# Altium schematic sheet Mach trai tim.SchDoc: Bài 1: Mạch trái tim
size A4; DrawnBy: Lai Phuoc Son; Address1: PCB Workshop 2017; Address3: Lpson.tth@gmail.com; Address4: 0905.912.019; Revision: V1-1; SheetNumber: 1; SheetTotal: 1; ModifiedDate: 2014-06-07
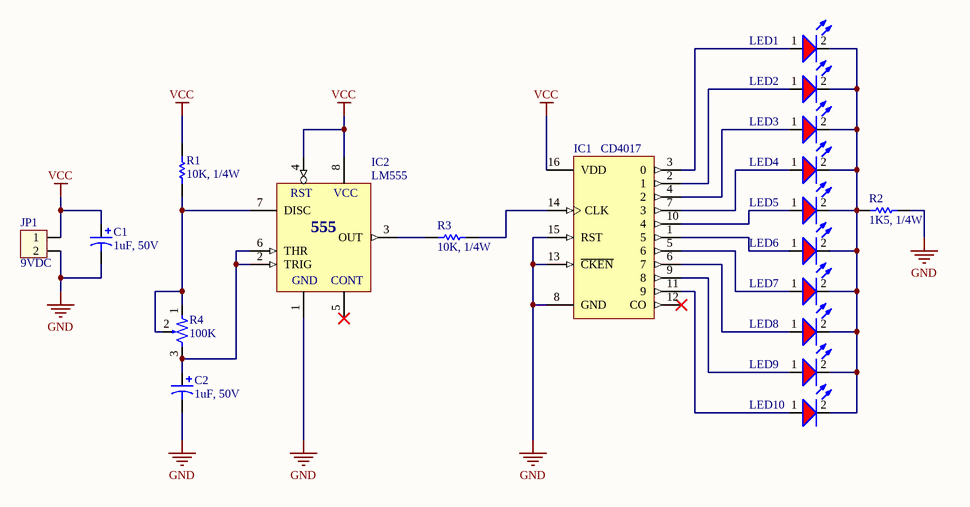
[diagram p0: Mach trai tim.SchDoc]

## Parts
C1  value 1uF, 50V  [CAP_1UF_50V]  (hidden comment: GSR10M016-0511TAF)
C2  value 1uF, 50V  [CAP_1UF_50V]  (hidden comment: GSR10M016-0511TAF)
IC1  CD4017  [74HC4017]
IC2  LM555  [LM555]
JP1  9VDC  [CON2]
LED1  LED_R_5  [LED5R]  (value not drawn)
LED2  LED_R_5  [LED5R]  (value not drawn)
LED3  LED_R_5  [LED5R]  (value not drawn)
LED4  LED_R_5  [LED5R]  (value not drawn)
LED5  LED_R_5  [LED5R]  (value not drawn)
LED6  LED_R_5  [LED5R]  (value not drawn)
LED7  LED_R_5  [LED5R]  (value not drawn)
LED8  LED_R_5  [LED5R]  (value not drawn)
LED9  LED_R_5  [LED5R]  (value not drawn)
LED10  LED_R_5  [LED5R]  (value not drawn)
R1  value 10K, 1/4W  [RES 1/4W CFR25]  (hidden comment: CF1/4W1KJ25)
R2  value 1K5, 1/4W  [RES 1/4W CFR25]  (hidden comment: CF1/4W1KJ25)
R3  value 10K, 1/4W  [RES 1/4W CFR25]  (hidden comment: CF1/4W1KJ25)
R4  100K  [VR1]

## Nets
GND: C1.2 C2.2 IC1.8(GND) IC1.13(~{CKEN}) IC1.15(RST) IC2.1(GND) JP1.2 R2.1
VCC: C1.1 IC1.16(VDD) IC2.4(RST) IC2.8(VCC) JP1.1 R1.2
NetC2_1: C2.1 IC2.2(TRIG) IC2.6(THR) R4.3
NetIC1_1: IC1.1(5) LED6.1(A)
NetIC1_2: IC1.2(1) LED2.1(A)
NetIC1_3: IC1.3(0) LED1.1(A)
NetIC1_4: IC1.4(2) LED3.1(A)
NetIC1_5: IC1.5(6) LED7.1(A)
NetIC1_6: IC1.6(7) LED8.1(A)
NetIC1_7: IC1.7(3) LED4.1(A)
NetIC1_9: IC1.9(8) LED9.1(A)
NetIC1_10: IC1.10(4) LED5.1(A)
NetIC1_11: IC1.11(9) LED10.1(A)
NetIC1_14: IC1.14(CLK) R3.1
NetIC2_3: IC2.3(OUT) R3.2
NetIC2_7: IC2.7(DISC) R1.1 R4.1 R4.2
NetLED1_2: LED1.2(K) LED2.2(K) LED3.2(K) LED4.2(K) LED5.2(K) LED6.2(K) LED7.2(K) LED8.2(K) LED9.2(K) LED10.2(K) R2.2

Not connected (* = marked no-connect by the designer): IC1 12(CO)*; IC2 5(CONT)*

## Notes on the sheet
- Title
- Size:
- Date:
- A4
- Number:
- Time:
- Revision:
- Sheet
- of
- File:
- (in symbol LM555) 555

## Library data of the parts
C1 C2 = GSR10M016-0511TAF: CAP GSR 0511 10uF 16V 20%; ComponentLink1Description: Datasheet; ComponentLink1URL: D:\Dropbox\Datasheets\Passive Components\Capacitors\GSR Aluminum electrolytic capacitors.pdf
IC1 = 4017: Decade Counter/Divider with 10 Decoded Outputs; Manufacturer: Texas Instruments; Manufacturer Part Number: CD74HC4017E; Designed by: VanDungEvn; Logic Type: Counter, Decade; Direction: Up; Number of Bits per Element: 10; Reset: Asynchronous; Count Rate: 35MHz; Trigger Type: Positive Edge; Voltage - Supply: 2 V ~ 6 V; Value: CD4017; Supplier 1: Digi-Key; Supplier Part Number 1: 296-25989-5-ND; RoHS: RoHS Compliant; Category: Integrated Circuits (ICs); Stock 1: 881; Pricing 1: 1=0.58, 10=0.508, 100=0.3896, 500=0.308, 1000=0.2464 (USD); Packaging: Tube; Part Status: Active; Timing: -; Operating Temperature: -55°C ~ 125°C; Mounting Type: Through Hole; Package / Case: 16-DIP (0.300", 7.62mm); Supplier Device Package: 16-PDIP; ComponentLink1URL: http://www.ti.com/lit/ds/symlink/cd74hc4017.pdf; ComponentLink1Description: http://www.ti.com/lit/ds/symlink/cd74hc4017.pdf
IC2 = LM555: Timer; Manufacturer: Texas Instruments; Manufacturer Part Number: NE555P; Frequency: 100kHz; Voltage - Supply: 4.5 V ~ 16 V; Current - Supply: 10mA; Value: LM555; Supplier 1: Digi-Key; Supplier Part Number 1: 296-1411-5-ND; RoHS: RoHS Compliant; Category: Integrated Circuits (ICs); Stock 1: 19810; Pricing 1: 1=0.44, 10=0.353, 100=0.24, 500=0.18, 1000=0.135 (USD); Packaging: Tube; Part Status: Active; Type: 555 Type, Timer/Oscillator (Single); Count: -; Operating Temperature: 0°C ~ 70°C; Package / Case: 8-DIP (0.300", 7.62mm); Supplier Device Package: 8-PDIP; Mounting Type: Through Hole; ComponentLink1URL: http://www.ti.com/lit/ds/symlink/ne555.pdf; ComponentLink1Description: http://www.ti.com/lit/ds/symlink/ne555.pdf
JP1 = Con2: Connector 2; Value: Connector 2
LED1-LED10 = LED_RED_5MM: LED Red 5mm; ComponentLink1Description: Datasheet; ComponentLink1URL: D:\Dropbox\Datasheets\Opto and Illumination\LEDs\SMD LED.pdf; Unit Price: 0.0476
R1-R3 = CF1/4W1KJ25: RES CF AXIAL-0.3 5% 1/4W 1K
R4 = VR2: Var Resistor; Value: 100K